# EasyEDA schematic SCH_Control_2024-03-24.json
TITLE: Sheet_1; REV: 1.0; Date: 2024-03-24; Sheet: 1/1; Company: Your Company
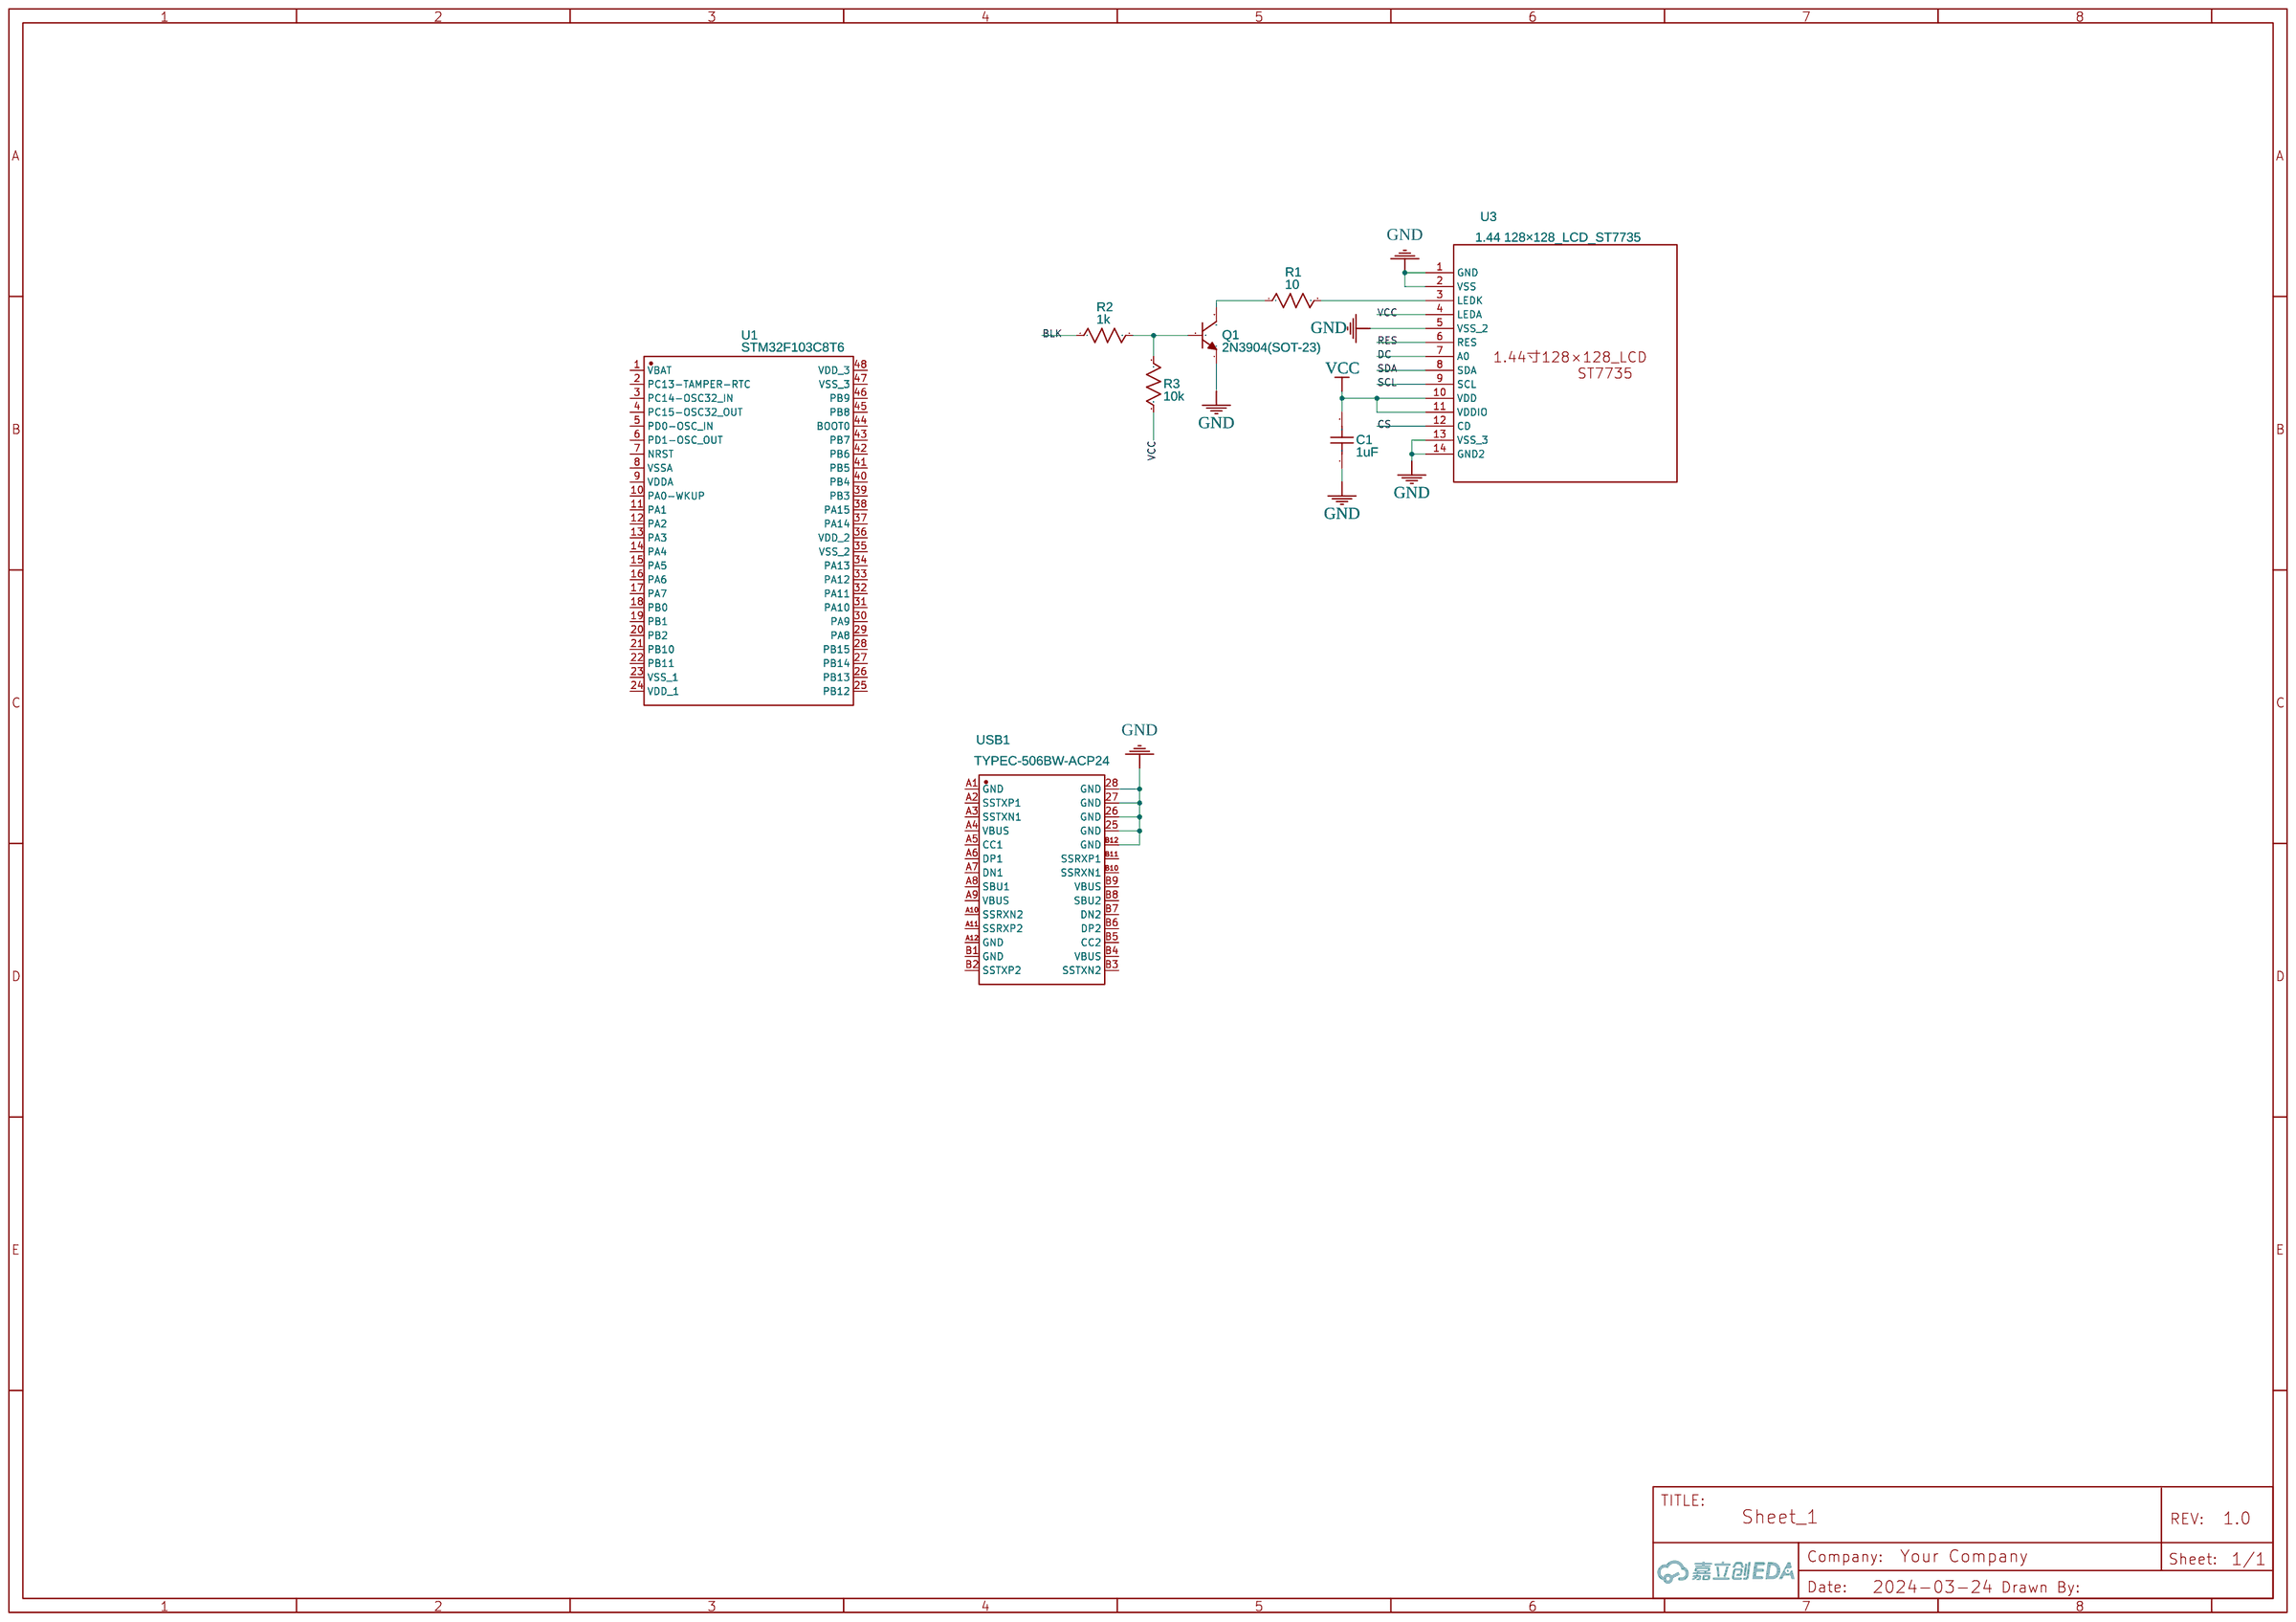
[diagram p0: schematic sheet]

## Parts
C1  1uF  [C0603]
Q1  2N3904(SOT-23)  [SOT-23-3_L2.9-W1.3-P1.90-LS2.4-TR]
R1  10  [R0603]
R2  1k  [R0603]
R3  10k  [R0603]
U1  STM32F103C8T6  [LQFP-48_L7.0-W7.0-P0.50-LS9.0-BL]
U3  1.44 128×128_LCD_ST7735  [1.44 128×128_LCD_ST7735【华迪短】]
USB1  TYPEC-506BW-ACP24  [USB-C-SMD_TYPEC-506BW-ACP24]

## Library data of the parts
C1 = C_0603_US: Contributor: LCEDA_Lib
Q1 = 2N3904(SOT-23): Supplier: LCSC; Manufacturer: KEC; Manufacturer Part: 2n3904S-RTK/PS; Supplier Part: C18536; Paste Type: SOT-23; Contributor: LCEDA_Lib
R1-R3 = R_0603_US: Contributor: LCEDA_Lib
U1 = STM32F103C8T6: Supplier: LCSC; Manufacturer: ST(意法半导体); Supplier Part: C8734; JLCPCB Part Class: Extended Part
U3 = 1.44 128×128_LCD_ST7735【华迪短】: Contributor: Mutiankai
USB1 = TYPEC-506BW-ACP24: Contributor: LCSC; Supplier: LCSC; Supplier Part: C2895019; Manufacturer: XUNPU(讯普); JLCPCB Part Class: Extended Part

## Nets
GND: C1.1 Q1.1(E) U3.1(GND) U3.2(VSS) U3.5(VSS_2) U3.13(VSS_3) U3.14(GND2) USB1.25(GND) USB1.26(GND) USB1.27(GND) USB1.28(GND) USB1.B12(GND)
VCC: C1.2 R3.1 U3.4(LEDA) U3.10(VDD) U3.11(VDDIO)
BLK: R2.1
CS: U3.12(CD)
DC: U3.7(A0)
RES: U3.6(RES)
SCL: U3.9(SCL)
SDA: U3.8(SDA)
Net-(Q1-2): Q1.2(B) R2.2 R3.2
Net-(Q1-3): Q1.3(C) R1.1
Net-(R1-2): R1.2 U3.3(LEDK)

Not connected (* = marked no-connect by the designer): U1 1(VBAT) 2(PC13-TAMPER-RTC) 3(PC14-OSC32_IN) 4(PC15-OSC32_OUT) 5(PD0-OSC_IN) 6(PD1-OSC_OUT) 7(NRST) 8(VSSA) 9(VDDA) 10(PA0-WKUP) 11(PA1) 12(PA2) 13(PA3) 14(PA4) 15(PA5) 16(PA6) 17(PA7) 18(PB0) 19(PB1) 20(PB2) 21(PB10) 22(PB11) 23(VSS_1) 24(VDD_1) 25(PB12) 26(PB13) 27(PB14) 28(PB15) 29(PA8) 30(PA9) 31(PA10) 32(PA11) 33(PA12) 34(PA13) 35(VSS_2) 36(VDD_2) 37(PA14) 38(PA15) 39(PB3) 40(PB4) 41(PB5) 42(PB6) 43(PB7) 44(BOOT0) 45(PB8) 46(PB9) 47(VSS_3) 48(VDD_3); USB1 A1(GND) A2(SSTXP1) A3(SSTXN1) A4(VBUS) A5(CC1) A6(DP1) A7(DN1) A8(SBU1) A9(VBUS) A10(SSRXN2) A11(SSRXP2) A12(GND) B1(GND) B2(SSTXP2) B3(SSTXN2) B4(VBUS) B5(CC2) B6(DP2) B7(DN2) B8(SBU2) B9(VBUS) B10(SSRXN1) B11(SSRXP1)
